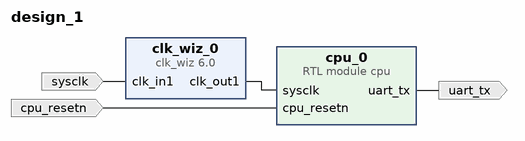
[diagram p0: block diagram of the top level]
# Vivado block design design_1, xc7a200tsbg484-1, Vivado 2020.1
create_bd_design design_1

create_bd_port -dir I sysclk
create_bd_port -dir I cpu_resetn
create_bd_port -dir O uart_tx

create_bd_cell -type ip -vlnv xilinx.com:ip:clk_wiz:6.0 clk_wiz_0
set_property -dict [list \
  CONFIG.CLKOUT1_JITTER 151.636 \
  CONFIG.CLKOUT1_REQUESTED_OUT_FREQ 50 \
  CONFIG.MMCM_CLKOUT0_DIVIDE_F 20.000 \
  CONFIG.USE_LOCKED false \
  CONFIG.USE_RESET false \
] [get_bd_cells clk_wiz_0]
create_bd_cell -type module -reference cpu cpu_0

# ---- connections ----

connect_bd_net [get_bd_pins clk_wiz_0/clk_out1] [get_bd_pins cpu_0/sysclk]
connect_bd_net [get_bd_ports sysclk] [get_bd_pins clk_wiz_0/clk_in1]
connect_bd_net [get_bd_ports cpu_resetn] [get_bd_pins cpu_0/cpu_resetn]
connect_bd_net [get_bd_pins cpu_0/uart_tx] [get_bd_ports uart_tx]

validate_bd_design
save_bd_design
